# Altium project Lab1_PCB_Project.PrjPcb
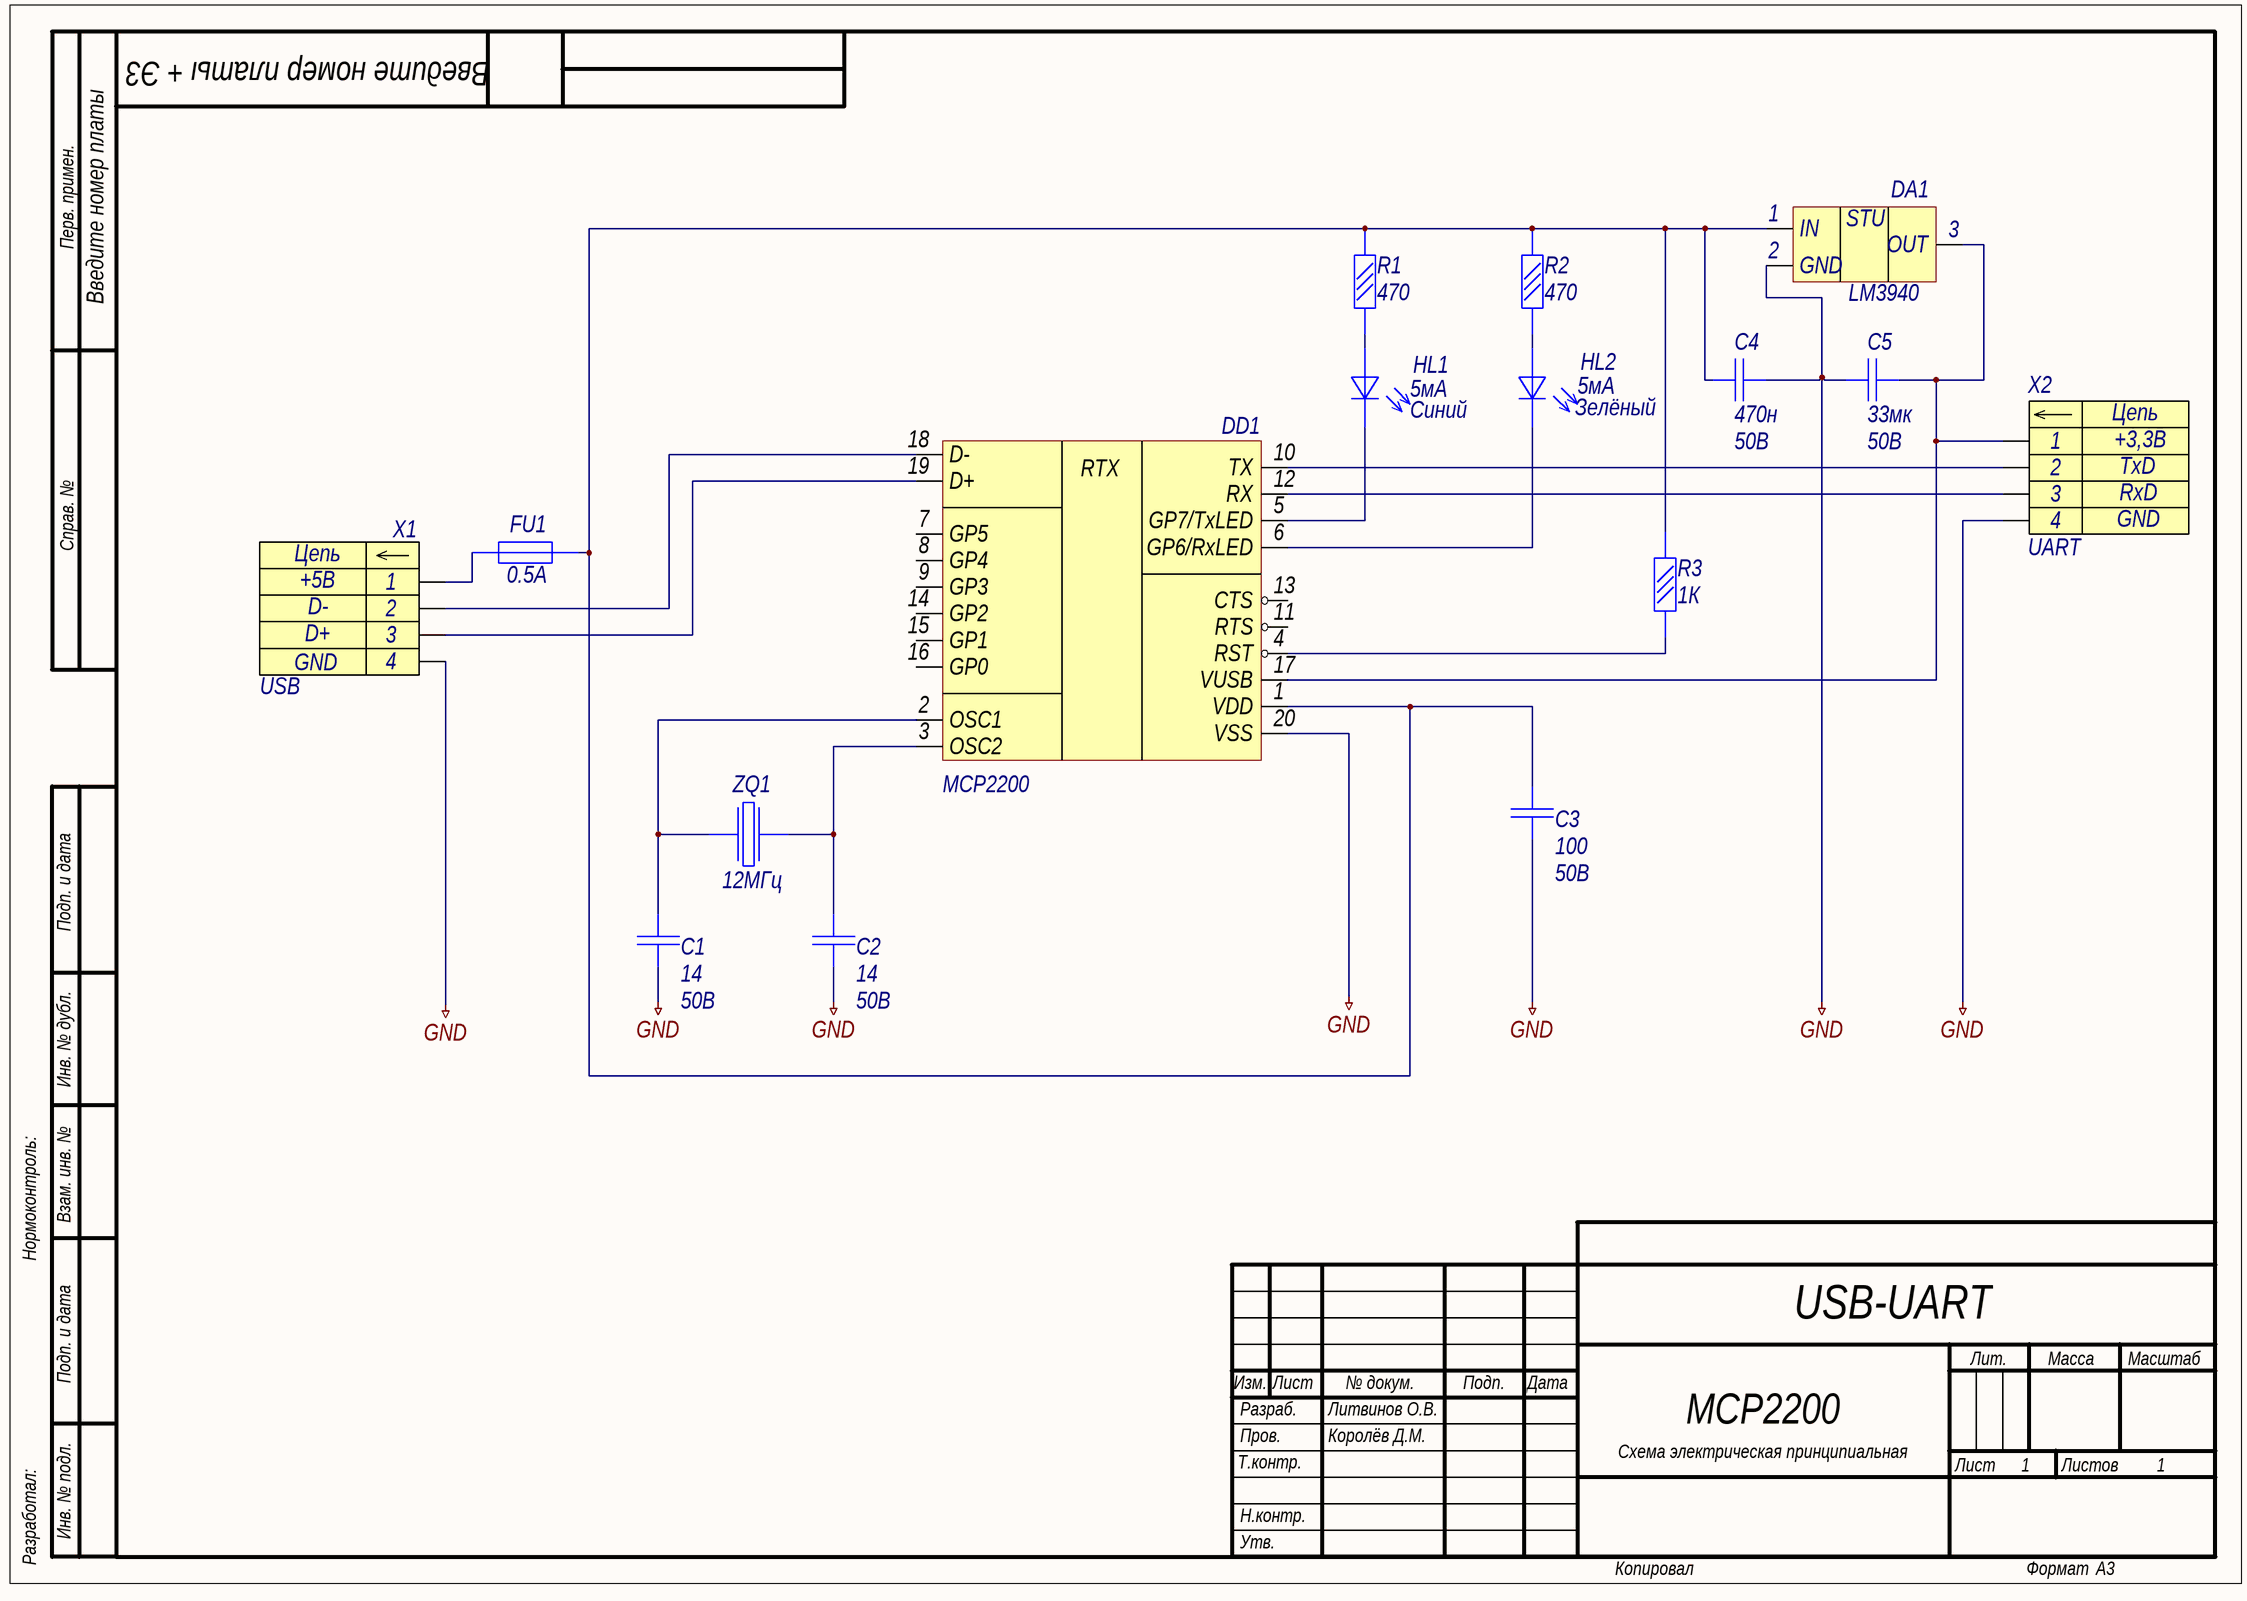
[diagram p0: Lab1_Scheme.SchDoc]
1 sheet, 16 parts. Net scope: global (net labels, ports and power ports of the same name join across sheets).
Board file: Lab1_PCB.PcbDoc

## Sheet Lab1_Scheme.SchDoc: Название платы
size 420 x 297 mm; ApprovedBy: Рогов; CheckedBy: Фамилия проверяющего; DrawnBy: Фамилия разработчика; DocumentNumber: Введите номер платы + Э3; SheetNumber: пусто если лист 1, иначе 1; SheetTotal: количество листов; Title1str: (при необходимости вторая строка); DocumentType: тип схемы; Format: A3; ImagePath: Введите номер платы

### Parts
C1  value 14  Voltage: 50В  [C0805]  (hidden comment: Capacitor)
C2  value 14  Voltage: 50В  [C0805]  (hidden comment: Capacitor)
C3  value 100  Voltage: 50В  [C0805]  (hidden comment: Capacitor)
C4  value 470н  Voltage: 50В  [C0805]  (hidden comment: Capacitor)
C5  value 33мк  Voltage: 50В  [C0805]  (hidden comment: Capacitor)
DA1  LM3940  [SOT95P255X145-3N]
DD1  MCP2200  WTF: RTX  [SOIC127P1030X265-20N]
FU1  value 0.5A  [F1812]  (hidden comment: Fuse)
HL1  Прямой ток: 5мА  Цвет: Синий  [LD0805]  (hidden comment: LED_3V)
HL2  Прямой ток: 5мА  Цвет: Зелёный  [LD0805]  (hidden comment: LED_3V)
R1  Сопротивление: 470  [R0805]  (hidden comment: Resistor_0,05W)
R2  Сопротивление: 470  [R0805]  (hidden comment: Resistor_0,05W)
R3  value 1К  [R0805]  (hidden comment: Resistor_0,05W)
X1  USB  U: +5В  Out: D-  In: D+  [USB]
X2  UART  In: TxD  Out: RxD  U: +3,3В  [UART]
ZQ1  Частота: 12МГц  [HC-49S]  (hidden comment: Crystal)

### Nets
GND: C1.1 C2.1 C3.2 C4.1 C5.2 DA1.2(GND) DD1.20(VSS) X1.4 X2.4
NetC1_2: C1.2 DD1.2(OSC1) ZQ1.1
NetC2_2: C2.2 DD1.3(OSC2) ZQ1.3
NetC3_1: C3.1 C4.2 DA1.1(IN) DD1.1(VDD) FU1.1 R1.2 R2.2 R3.2
NetC5_1: C5.1 DA1.3(OUT) DD1.17(VUSB) X2.1
NetDD1_4: DD1.4(RST) R3.1
NetDD1_5: DD1.5(GP7/TxLED) HL1.2(К)
NetDD1_6: DD1.6(GP6/RxLED) HL2.2(К)
NetDD1_10: DD1.10(TX) X2.2
NetDD1_12: DD1.12(RX) X2.3
NetDD1_18: DD1.18(D-) X1.2
NetDD1_19: DD1.19(D+) X1.3
NetFU1_2: FU1.2 X1.1
NetHL1_1: HL1.1(А) R1.1
NetHL2_1: HL2.1(А) R2.1

Not connected (* = marked no-connect by the designer): DD1 7(GP5) 8(GP4) 9(GP3) 11(RTS) 13(CTS) 14(GP2) 15(GP1) 16(GP0)

### Notes on the sheet
- Перв. примен.
- (near C5) +
- Справ. №
- Подп. и дата
- Инв. № дубл.
- Нормоконтроль:
- Взам. инв. №
- USB-UART
- Изм.
- Лист
- № докум.
- Подп.
- Дата
- Лит.
- Масса
- Масштаб
- Т.контр.
- Пров.
- Разраб.
- Королёв Д.М.
- Литвинов О.В.
- MCP2200
- Схема электрическая принципиальная
- 1
- Листов
- Разработал:
- Инв. № подл.
- Н.контр.
- Утв.
- Копировал
- Формат
- (in symbol LM3940) STU
- (in symbol UART) Цепь
- (in symbol USB) Цепь

### Library data of the parts
C1-C5 = Capacitor: Type: Конденсатор
DD1 = MCP2200: Create: Litvinov
HL1 HL2 = Led-1: Type: Индикатор единичный; Прямое напряжение: 3В; Произв. номер: SMLE13EC8TT86; Published: 03.12.2013; Publisher: Andrew Danich
X1 = USB: Create: Litvinov; GND: GND
X2 = UART: Create: Litvinov; GND: GND
DA1 = LM3940: Item ID: LM3940
FU1 = Fuse: Type: Вставка плавкая
R1-R3 = Resistor_0,05W: Type: Резистор
ZQ1 = Crystal: Published: 08.03.2013; Publisher: Andrew Danich; Type: Резонатор